# Altium schematic sheet Display.SchDoc
size A4
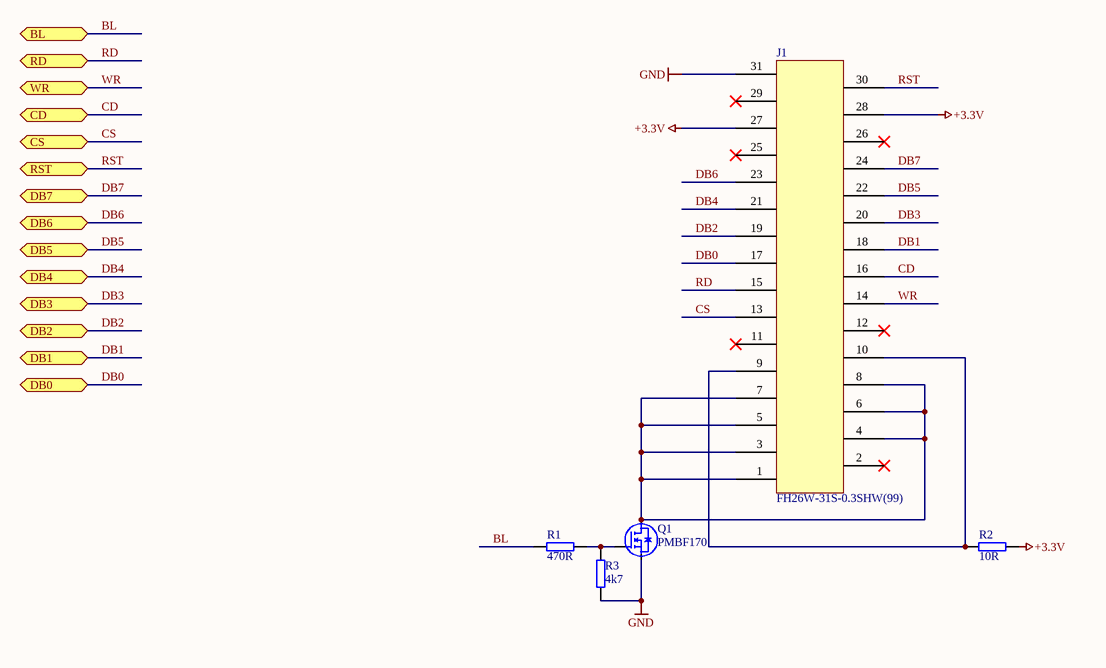
[diagram p0: Display.SchDoc]

## Parts
J1  FH26W-31S-0.3SHW(99)  [FH26W-31S-0.3SHW(99)]
Q1  PMBF170  [SOT23]
R1  470R  [RES 0805]
R2  10R  [RES 0805]
R3  4k7  [RES 0805]

## Ports
BL (bidir), CD (bidir), CS (bidir), DB0 (bidir), DB1 (bidir), DB2 (bidir), DB3 (bidir), DB4 (bidir), DB5 (bidir), DB6 (bidir), DB7 (bidir), RD (bidir), RST (bidir), WR (bidir)

## Nets
+3.3V: J1.27 J1.28 R2.1
GND: J1.31 Q1.2(S) R3.1
BL: R1.1 ; port BL
CD: J1.16 ; port CD
CS: J1.13 ; port CS
DB0: J1.17 ; port DB0
DB1: J1.18 ; port DB1
DB2: J1.19 ; port DB2
DB3: J1.20 ; port DB3
DB4: J1.21 ; port DB4
DB5: J1.22 ; port DB5
DB6: J1.23 ; port DB6
DB7: J1.24 ; port DB7
RD: J1.15 ; port RD
RST: J1.30 ; port RST
WR: J1.14 ; port WR
NetJ1_1: J1.1 J1.3 J1.4 J1.5 J1.6 J1.7 J1.8 Q1.3(D)
NetJ1_9: J1.9 J1.10 R2.2
NetQ1_1: Q1.1(G) R1.2 R3.2

Not connected (* = marked no-connect by the designer): J1 2* 11* 12* 25* 26* 29*

## Library data of the parts
J1 = FH26W-31S-0.3SHW(99): Hirose FH26 0.3mm Pitch 31 Way Right Angle SMT Female FPC Connector, ZIF Bottom Contact; RS Components: 738-8877; Manufacturer: Hirose; Name: FH26W-31S-0.3SHW(99)
Q1 = PMBF170: N-Channel MOSFET; Name: PMBF170; Datasheet: https://assets.nexperia.com/documents/data-sheet/PMBF170.pdf
R1-R3 = RES: RESISTOR
  R1: REFERENCE ID: *; DISTRIBUTOR: *; VALUE: 470R
  R2: Reference: 81-10-83; Supplier: LOMEX; VALUE: 10R
  R3: REFERENCE ID: *; DISTRIBUTOR: *; VALUE: 4k7